# Altium project Projekt_Spannungsmessung_15kV.PrjPcb
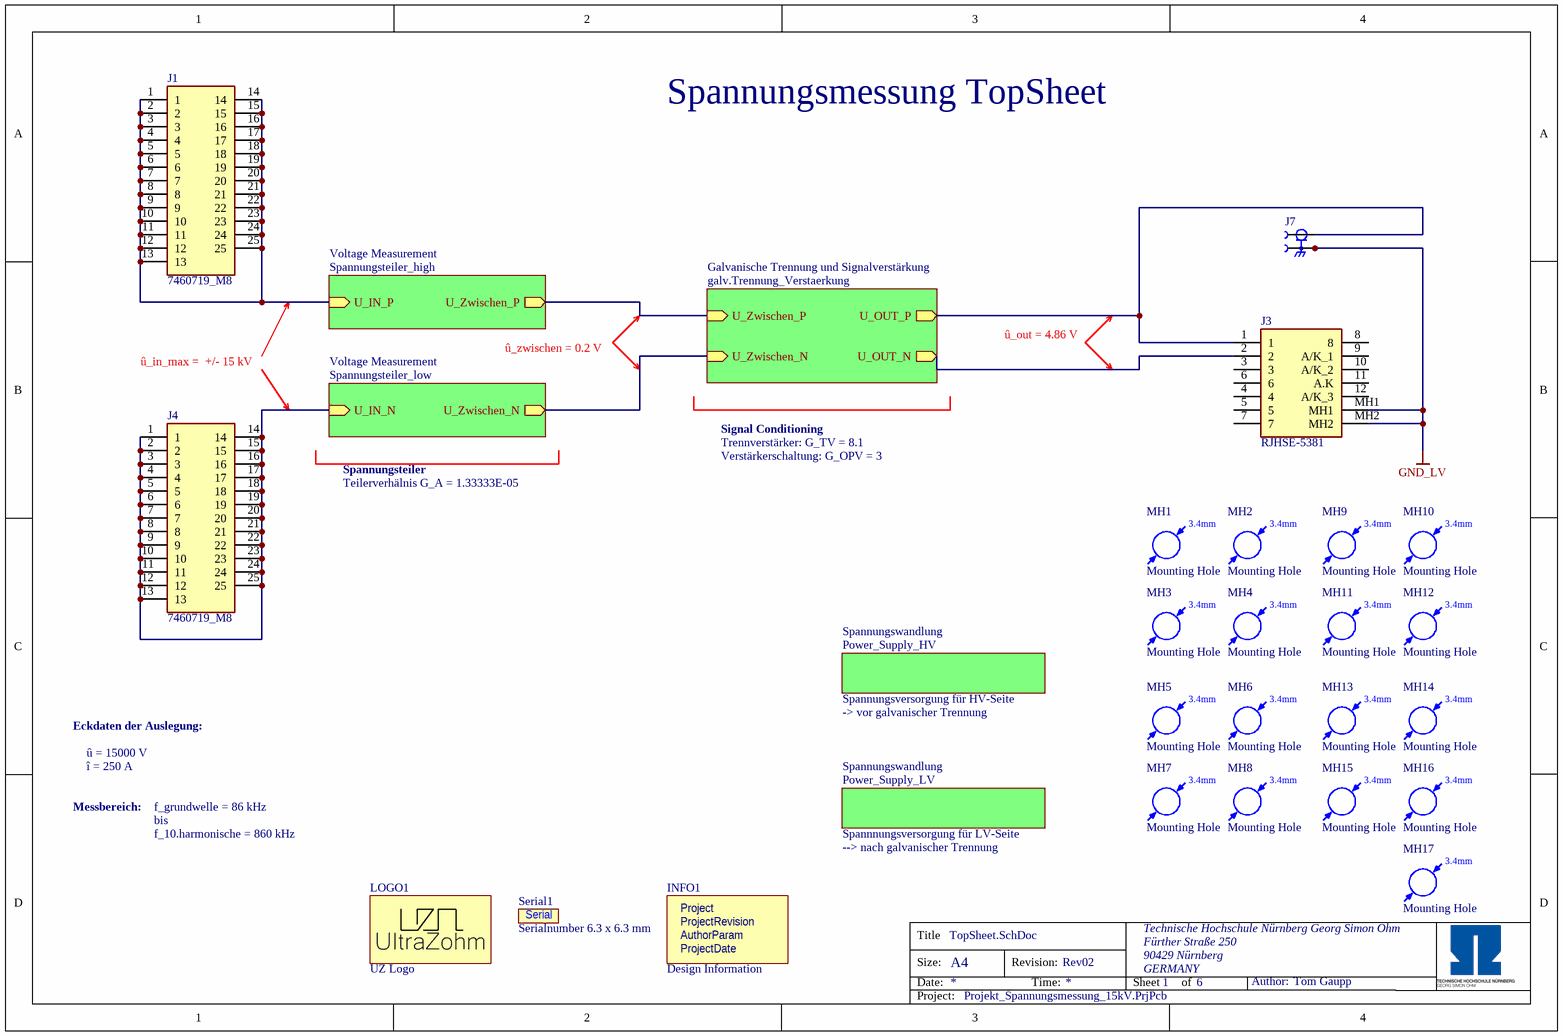
[diagram p0: TopSheet.SchDoc]
Author: Tom Gaupp; AuthorParam: T. Gaupp; Project: Spannungsmessung; ProjectDate: 08/23; ProjectRevision: Rev02
6 sheets, 368 parts. Net scope: hierarchical (ports join the sheet entries above them; power ports are global).
Board file: PCB_SpannungsmessungNEU.PcbDoc
Sheets:
  TopSheet.SchDoc
    Voltage Measurement = Spannungsteiler_high.SchDoc
    Spannungswandlung = Power_Supply_LV.SchDoc
    Spannungswandlung = Power_Supply_HV.SchDoc
    Galvanische Trennung und Signalverstärkung = galv.Trennung_Verstaerkung.SchDoc
    Voltage Measurement = Spannungsteiler_low.SchDoc

## Sheet TopSheet.SchDoc
size A4; Author: T. Gaupp; CompanyName: Technische Hochschule Nürnberg Georg Simon Ohm; Address1: Fürther Straße 250; Address2: 90429 Nürnberg; Address3: GERMANY; Revision: Rev02; SheetNumber: 1; SheetTotal: 6; CompanyName2: Institut ELSYS

### Parts
INFO1  Design Information  [Design_info]  (no BOM)
J1  7460719_M8  [7460719]
J3  RJHSE-5381  [RJHSE5381]
J4  7460719_M8  [7460719]
J7  BNC5-J-P-GN-ST-TH2D_new  [BNC5-J-P-GN-ST-TH2D_new]  (value not drawn)
LOGO1  UZ Logo  [UZ_Logo_small]  (no BOM)
MH1  Mounting Hole  [MH_3.4]
MH2  Mounting Hole  [MH_3.4]
MH3  Mounting Hole  [MH_3.4]
MH4  Mounting Hole  [MH_3.4]
MH5  Mounting Hole  [MH_3.4]
MH6  Mounting Hole  [MH_3.4]
MH7  Mounting Hole  [MH_3.4]
MH8  Mounting Hole  [MH_3.4]
MH9  Mounting Hole  [MH_3.4]
MH10  Mounting Hole  [MH_3.4]
MH11  Mounting Hole  [MH_3.4]
MH12  Mounting Hole  [MH_3.4]
MH13  Mounting Hole  [MH_3.4]
MH14  Mounting Hole  [MH_3.4]
MH15  Mounting Hole  [MH_3.4]
MH16  Mounting Hole  [MH_3.4]
MH17  Mounting Hole  [MH_3.4]
Serial1  Serialnumber 6.3 x 6.3 mm  [SERIAL_6.3X6.3MM]  (no BOM)

### Sub-sheets
Galvanische Trennung und Signalverstärkung = galv.Trennung_Verstaerkung: U_Zwischen_P (in), U_Zwischen_N (in), U_OUT_N (out), U_OUT_P (out)
Spannungswandlung = Power_Supply_LV: no entries
Spannungswandlung = Power_Supply_HV: no entries
Voltage Measurement = Spannungsteiler_high: U_IN_P (in), U_Zwischen_P (out)
Voltage Measurement = Spannungsteiler_low: U_IN_N (in), U_Zwischen_N (out)

### Nets
GND_LV: J3.MH1 J3.MH2 J7.S_1 J7.S_2 J7.S_3
U_OUT_N: J3.1 J7.1 ; sheet Galvanische Trennung und Signalverstärkung/U_OUT_P
U_OUT_P: J3.2 ; sheet Galvanische Trennung und Signalverstärkung/U_OUT_N
U_Zwischen_N: sheet Galvanische Trennung und Signalverstärkung/U_Zwischen_N, sheet Voltage Measurement/U_Zwischen_N
U_Zwischen_P: sheet Voltage Measurement/U_Zwischen_P, sheet Galvanische Trennung und Signalverstärkung/U_Zwischen_P
NetC13_1: J1.1 J1.2 J1.3 J1.4 J1.5 J1.6 J1.7 J1.8 J1.9 J1.10 J1.11 J1.12 J1.13 J1.14 J1.15 J1.16 J1.17 J1.18 J1.19 J1.20 J1.21 J1.22 J1.23 J1.24 J1.25 ; sheet Voltage Measurement/U_IN_P
NetC90_1: J4.1 J4.2 J4.3 J4.4 J4.5 J4.6 J4.7 J4.8 J4.9 J4.10 J4.11 J4.12 J4.13 J4.14 J4.15 J4.16 J4.17 J4.18 J4.19 J4.20 J4.21 J4.22 J4.23 J4.24 J4.25 ; sheet Voltage Measurement/U_IN_N

Not connected (* = marked no-connect by the designer): J3 3 4 5 6 7 8 9(A/K_1) 10(A/K_2) 11(A.K) 12(A/K_3)

### Notes on the sheet
- Spannungsmessung TopSheet
- û_in_max =  +/- 15 kV
- û_zwischen = 0.2 V
- û_out = 4.86 V
- Signal Conditioning
- Trennverstärker: G_TV = 8.1
- Spannungsteiler
- Teilerverhälnis G_A = 1.33333E-05
- Verstärkerschaltung: G_OPV = 3
- Spannungsversorgung für HV-Seite
- -> vor galvanischer Trennung
- Eckdaten der Auslegung:
- î = 250 A
- û = 15000 V
- Messbereich:
- f_grundwelle = 86 kHz
- f_10.harmonische = 860 kHz
- bis
- Spannnungsversorgung für LV-Seite
- --> nach galvanischer Trennung
- Title
- Size:
- Date:
- A4
- Revision:
- Time:
- Sheet
- of
- Author:
- Project:
- (in symbol Design Information) Project; ProjectRevision; AuthorParam; ProjectDate
- (in symbol Mounting Hole) 3.4mm
- (in symbol Serial Number) Serial

### Library data of the parts
INFO1 = Design Information: Design InformationS; Manufacturer: UltraZohm; Created from: MGremer; Manufacturer Part Number: Design Information; PartID: 12; Created On: 03.11.2021 09:04:23; ComponentLink1Description: https://docs.ultrazohm.com/; ComponentLink1URL: homepage; Component Type: Design Information; Last Updated: 03.11.2021 09:28:34; Supplier 1: -; Supplier Part Number 1: -; Type: Design Information; Value: Design Information; Live Cycle Status: 1
J1 J4 = 7460719_M8: Connector; Manufacturer_Name: Wurth Elektronik; Datasheet Link: https://www.mouser.com/datasheet/2/445/7460719-1723637.pdf; Height: 20.5mm; Manufacturer_Part_Number: 7460719; Mouser Part Number: 710-7460719; Mouser Price/Stock: https://www.mouser.co.uk/ProductDetail/Wurth-Elektronik/7460719?qs=lykWx4dhCCHoCGzpKhOnqA%3D%3D; Supplier 1: Mouser; Supplier Part Number 1: 710-7460719
J3 = RJHSE-5381: CAT5, RJ45 Connector, 1 port; Manufacturer: Amphenol; Created from: DHufnagel; Manufacturer Part Number: RJHSE-5381; PartID: 5; Created On: 14.06.2022 08:36:24; ComponentLink1Description: Datasheet; ComponentLink1URL: https://www.mouser.de/datasheet/2/18/1/io_modjack_rjhse-2509079.pdf; ComponentLink2Description: Drawing; ComponentLink2URL: https://cdn.amphenol-cs.com/media/wysiwyg/files/drawing/rjhsex38x.pdf; Component Type: RJ45 Connector; Device Package: RJ45; Last Updated: 14.06.2022 08:36:42; Mounting Type: THT; Series: RJHSE; Supplier 1: Mouser; Supplier Part Number 1: 523-RJHSE-5381; Type: RJ45 Connector; Live Cycle Status: 1; Stock number: not stored
J7 = BNC5-J-P-GN-ST-TH2D_new: BNC Connector; Supplier 1: Mouser; Supplier Part Number 1: 200-BNC5JPGNSTTH2D
LOGO1 = Logo small: Manufacturer: UltraZohm; Created from: MGremer; Created: Jan2021_Liegmann; Value: Logo; Manufacturer Part Number: Logo small; PartID: 10; Created On: 03.11.2021 09:04:23; ComponentLink1Description: https://docs.ultrazohm.com/; ComponentLink1URL: homepage; Component Type: Logo; Last Updated: 03.11.2021 09:05:50; Supplier 1: -; Supplier Part Number 1: -; Type: Logo; Live Cycle Status: 1
MH1-MH17 = Mounting Hole: Created from: MHlatky; Manufacturer Part Number: Mounting Hole; PartID: 16; Created On: 26.01.2021 09:19:51; ComponentLink1Description: Datasheet; Component Type: Mounting Hole; Device Package: -; Last Updated: 21.03.2022 23:05:12; Manufacturer: Mounting Hole; Supplier 1: Mounting Hole; Supplier Part Number 1: Mounting Hole; Type: Mounting Hole; Value: Mounting Hole; Live Cycle Status: 1; Stock number: not stored
Serial1 = Serial Number: Manufacturer: UltraZohm; Value: REV; Created from: MGremer; Created: 2018_09_18_AGeiger; Manufacturer Part Number: Serial Number; PartID: 11; Created On: 03.11.2021 09:04:23; ComponentLink1Description: https://docs.ultrazohm.com/; ComponentLink1URL: homepage; Component Type: Serial Number; Last Updated: 03.11.2021 09:28:34; Supplier 1: -; Supplier Part Number 1: -; Type: Serial Number; Live Cycle Status: 1

## Sheet Spannungsteiler_high.SchDoc
size A4; Author: T. Gaupp; CompanyName: Technische Hochschule Nürnberg Georg Simon Ohm; Address1: Fürther Straße 250; Address2: 90429 Nürnberg; Address3: GERMANY; SheetNumber: 4; SheetTotal: 6; CompanyName2: Institut ELSYS
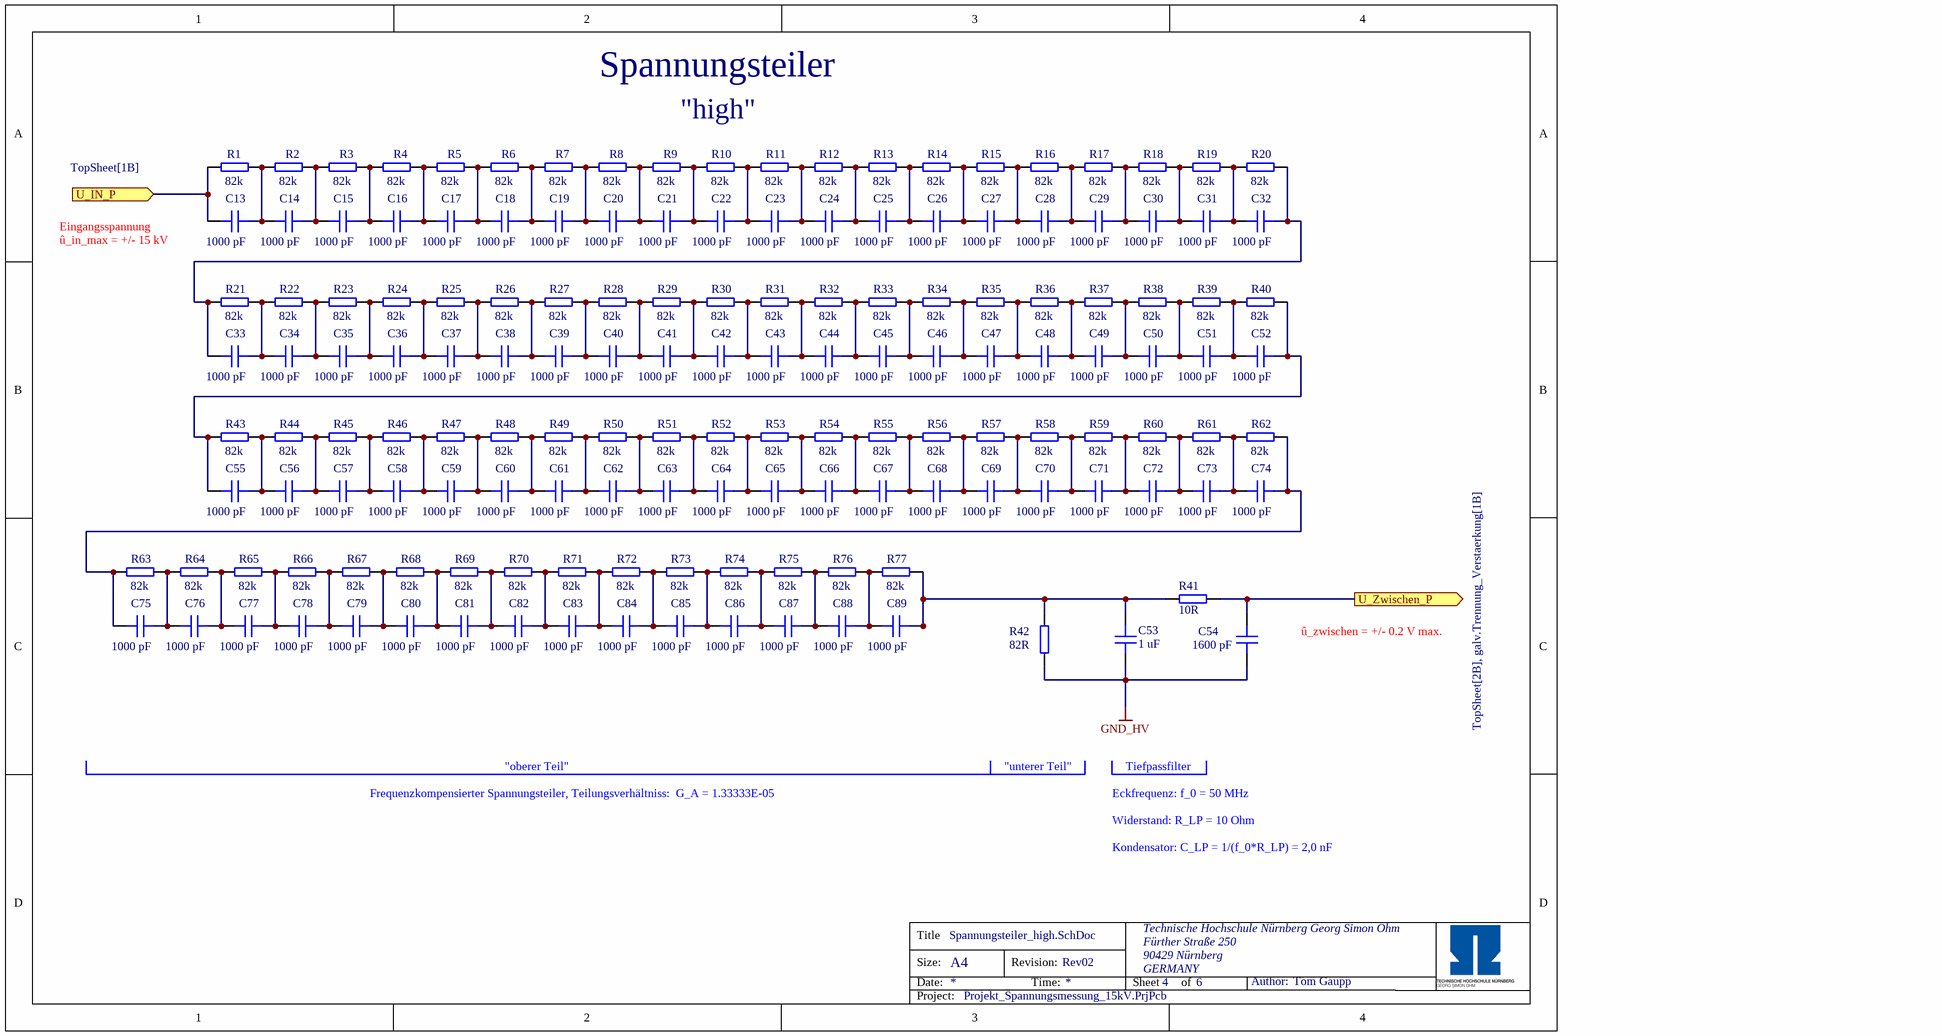
[diagram p1: Spannungsteiler_high.SchDoc]

### Parts
C13  1000 pF  [C_1206]
C14  1000 pF  [C_1206]
C15  1000 pF  [C_1206]
C16  1000 pF  [C_1206]
C17  1000 pF  [C_1206]
C18  1000 pF  [C_1206]
C19  1000 pF  [C_1206]
C20  1000 pF  [C_1206]
C21  1000 pF  [C_1206]
C22  1000 pF  [C_1206]
C23  1000 pF  [C_1206]
C24  1000 pF  [C_1206]
C25  1000 pF  [C_1206]
C26  1000 pF  [C_1206]
C27  1000 pF  [C_1206]
C28  1000 pF  [C_1206]
C29  1000 pF  [C_1206]
C30  1000 pF  [C_1206]
C31  1000 pF  [C_1206]
C32  1000 pF  [C_1206]
C33  1000 pF  [C_1206]
C34  1000 pF  [C_1206]
C35  1000 pF  [C_1206]
C36  1000 pF  [C_1206]
C37  1000 pF  [C_1206]
C38  1000 pF  [C_1206]
C39  1000 pF  [C_1206]
C40  1000 pF  [C_1206]
C41  1000 pF  [C_1206]
C42  1000 pF  [C_1206]
C43  1000 pF  [C_1206]
C44  1000 pF  [C_1206]
C45  1000 pF  [C_1206]
C46  1000 pF  [C_1206]
C47  1000 pF  [C_1206]
C48  1000 pF  [C_1206]
C49  1000 pF  [C_1206]
C50  1000 pF  [C_1206]
C51  1000 pF  [C_1206]
C52  1000 pF  [C_1206]
C53  1 uF  [C_1206]
C54  1600 pF  [C_1206]
C55  1000 pF  [C_1206]
C56  1000 pF  [C_1206]
C57  1000 pF  [C_1206]
C58  1000 pF  [C_1206]
C59  1000 pF  [C_1206]
C60  1000 pF  [C_1206]
C61  1000 pF  [C_1206]
C62  1000 pF  [C_1206]
C63  1000 pF  [C_1206]
C64  1000 pF  [C_1206]
C65  1000 pF  [C_1206]
C66  1000 pF  [C_1206]
C67  1000 pF  [C_1206]
C68  1000 pF  [C_1206]
C69  1000 pF  [C_1206]
C70  1000 pF  [C_1206]
C71  1000 pF  [C_1206]
C72  1000 pF  [C_1206]
C73  1000 pF  [C_1206]
C74  1000 pF  [C_1206]
C75  1000 pF  [C_1206]
C76  1000 pF  [C_1206]
C77  1000 pF  [C_1206]
C78  1000 pF  [C_1206]
C79  1000 pF  [C_1206]
C80  1000 pF  [C_1206]
C81  1000 pF  [C_1206]
C82  1000 pF  [C_1206]
C83  1000 pF  [C_1206]
C84  1000 pF  [C_1206]
C85  1000 pF  [C_1206]
C86  1000 pF  [C_1206]
C87  1000 pF  [C_1206]
C88  1000 pF  [C_1206]
C89  1000 pF  [C_1206]
R1  82k  [RES 1206_3216]
R2  82k  [RES 1206_3216]
R3  82k  [RES 1206_3216]
R4  82k  [RES 1206_3216]
R5  82k  [RES 1206_3216]
R6  82k  [RES 1206_3216]
R7  82k  [RES 1206_3216]
R8  82k  [RES 1206_3216]
R9  82k  [RES 1206_3216]
R10  82k  [RES 1206_3216]
R11  82k  [RES 1206_3216]
R12  82k  [RES 1206_3216]
R13  82k  [RES 1206_3216]
R14  82k  [RES 1206_3216]
R15  82k  [RES 1206_3216]
R16  82k  [RES 1206_3216]
R17  82k  [RES 1206_3216]
R18  82k  [RES 1206_3216]
R19  82k  [RES 1206_3216]
R20  82k  [RES 1206_3216]
R21  82k  [RES 1206_3216]
R22  82k  [RES 1206_3216]
R23  82k  [RES 1206_3216]
R24  82k  [RES 1206_3216]
R25  82k  [RES 1206_3216]
R26  82k  [RES 1206_3216]
R27  82k  [RES 1206_3216]
R28  82k  [RES 1206_3216]
R29  82k  [RES 1206_3216]
R30  82k  [RES 1206_3216]
R31  82k  [RES 1206_3216]
R32  82k  [RES 1206_3216]
R33  82k  [RES 1206_3216]
R34  82k  [RES 1206_3216]
R35  82k  [RES 1206_3216]
R36  82k  [RES 1206_3216]
R37  82k  [RES 1206_3216]
R38  82k  [RES 1206_3216]
R39  82k  [RES 1206_3216]
R40  82k  [RES 1206_3216]
R41  10R  [RES 0603_1608]
R42  82R  [RES 1206_3216]
R43  82k  [RES 1206_3216]
R44  82k  [RES 1206_3216]
R45  82k  [RES 1206_3216]
R46  82k  [RES 1206_3216]
R47  82k  [RES 1206_3216]
R48  82k  [RES 1206_3216]
R49  82k  [RES 1206_3216]
R50  82k  [RES 1206_3216]
R51  82k  [RES 1206_3216]
R52  82k  [RES 1206_3216]
R53  82k  [RES 1206_3216]
R54  82k  [RES 1206_3216]
R55  82k  [RES 1206_3216]
R56  82k  [RES 1206_3216]
R57  82k  [RES 1206_3216]
R58  82k  [RES 1206_3216]
R59  82k  [RES 1206_3216]
R60  82k  [RES 1206_3216]
R61  82k  [RES 1206_3216]
R62  82k  [RES 1206_3216]
R63  82k  [RES 1206_3216]
R64  82k  [RES 1206_3216]
R65  82k  [RES 1206_3216]
R66  82k  [RES 1206_3216]
R67  82k  [RES 1206_3216]
R68  82k  [RES 1206_3216]
R69  82k  [RES 1206_3216]
R70  82k  [RES 1206_3216]
R71  82k  [RES 1206_3216]
R72  82k  [RES 1206_3216]
R73  82k  [RES 1206_3216]
R74  82k  [RES 1206_3216]
R75  82k  [RES 1206_3216]
R76  82k  [RES 1206_3216]
R77  82k  [RES 1206_3216]

### Ports
U_IN_P (in, see TopSheet[1B]), U_Zwischen_P (out, see TopSheet[2B], galv.Trennung_Verstaerkung[1B])

### Nets
GND_HV: C53.1 C54.1 R42.1
U_Zwischen_P: C54.2 R41.2 ; port U_Zwischen_P
NetC13_1: C13.1 R1.1 ; port U_IN_P
NetC13_2: C13.2 C14.1 R1.2 R2.1
NetC14_2: C14.2 C15.1 R2.2 R3.1
NetC15_2: C15.2 C16.1 R3.2 R4.1
NetC16_2: C16.2 C17.1 R4.2 R5.1
NetC17_2: C17.2 C18.1 R5.2 R6.1
NetC18_2: C18.2 C19.1 R6.2 R7.1
NetC19_2: C19.2 C20.1 R7.2 R8.1
NetC20_2: C20.2 C21.1 R8.2 R9.1
NetC21_2: C21.2 C22.1 R9.2 R10.1
NetC22_2: C22.2 C23.1 R10.2 R11.1
NetC23_2: C23.2 C24.1 R11.2 R12.1
NetC24_2: C24.2 C25.1 R12.2 R13.1
NetC25_2: C25.2 C26.1 R13.2 R14.1
NetC26_2: C26.2 C27.1 R14.2 R15.1
NetC27_2: C27.2 C28.1 R15.2 R16.1
NetC28_2: C28.2 C29.1 R16.2 R17.1
NetC29_2: C29.2 C30.1 R17.2 R18.1
NetC30_2: C30.2 C31.1 R18.2 R19.1
NetC31_2: C31.2 C32.1 R19.2 R20.1
NetC32_2: C32.2 C33.1 R20.2 R21.1
NetC33_2: C33.2 C34.1 R21.2 R22.1
NetC34_2: C34.2 C35.1 R22.2 R23.1
NetC35_2: C35.2 C36.1 R23.2 R24.1
NetC36_2: C36.2 C37.1 R24.2 R25.1
NetC37_2: C37.2 C38.1 R25.2 R26.1
NetC38_2: C38.2 C39.1 R26.2 R27.1
NetC39_2: C39.2 C40.1 R27.2 R28.1
NetC40_2: C40.2 C41.1 R28.2 R29.1
NetC41_2: C41.2 C42.1 R29.2 R30.1
NetC42_2: C42.2 C43.1 R30.2 R31.1
NetC43_2: C43.2 C44.1 R31.2 R32.1
NetC44_2: C44.2 C45.1 R32.2 R33.1
NetC45_2: C45.2 C46.1 R33.2 R34.1
NetC46_2: C46.2 C47.1 R34.2 R35.1
NetC47_2: C47.2 C48.1 R35.2 R36.1
NetC48_2: C48.2 C49.1 R36.2 R37.1
NetC49_2: C49.2 C50.1 R37.2 R38.1
NetC50_2: C50.2 C51.1 R38.2 R39.1
NetC51_2: C51.2 C52.1 R39.2 R40.1
NetC52_2: C52.2 C55.1 R40.2 R43.1
NetC53_2: C53.2 C89.2 R41.1 R42.2 R77.2
NetC55_2: C55.2 C56.1 R43.2 R44.1
NetC56_2: C56.2 C57.1 R44.2 R45.1
NetC57_2: C57.2 C58.1 R45.2 R46.1
NetC58_2: C58.2 C59.1 R46.2 R47.1
NetC59_2: C59.2 C60.1 R47.2 R48.1
NetC60_2: C60.2 C61.1 R48.2 R49.1
NetC61_2: C61.2 C62.1 R49.2 R50.1
NetC62_2: C62.2 C63.1 R50.2 R51.1
NetC63_2: C63.2 C64.1 R51.2 R52.1
NetC64_2: C64.2 C65.1 R52.2 R53.1
NetC65_2: C65.2 C66.1 R53.2 R54.1
NetC66_2: C66.2 C67.1 R54.2 R55.1
NetC67_2: C67.2 C68.1 R55.2 R56.1
NetC68_2: C68.2 C69.1 R56.2 R57.1
NetC69_2: C69.2 C70.1 R57.2 R58.1
NetC70_2: C70.2 C71.1 R58.2 R59.1
NetC71_2: C71.2 C72.1 R59.2 R60.1
NetC72_2: C72.2 C73.1 R60.2 R61.1
NetC73_2: C73.2 C74.1 R61.2 R62.1
NetC74_2: C74.2 C75.1 R62.2 R63.1
NetC75_2: C75.2 C76.1 R63.2 R64.1
NetC76_2: C76.2 C77.1 R64.2 R65.1
NetC77_2: C77.2 C78.1 R65.2 R66.1
NetC78_2: C78.2 C79.1 R66.2 R67.1
NetC79_2: C79.2 C80.1 R67.2 R68.1
NetC80_2: C80.2 C81.1 R68.2 R69.1
NetC81_2: C81.2 C82.1 R69.2 R70.1
NetC82_2: C82.2 C83.1 R70.2 R71.1
NetC83_2: C83.2 C84.1 R71.2 R72.1
NetC84_2: C84.2 C85.1 R72.2 R73.1
NetC85_2: C85.2 C86.1 R73.2 R74.1
NetC86_2: C86.2 C87.1 R74.2 R75.1
NetC87_2: C87.2 C88.1 R75.2 R76.1
NetC88_2: C88.2 C89.1 R76.2 R77.1

### Notes on the sheet
- Spannungsteiler
- "high"
- Eingangsspannung
- û_in_max = +/- 15 kV
- û_zwischen = +/- 0.2 V max.
- "oberer Teil"
- "unterer Teil"
- Tiefpassfilter
- Frequenzkompensierter Spannungsteiler, Teilungsverhältniss:  G_A = 1.33333E-05
- Eckfrequenz: f_0 = 50 MHz
- Widerstand: R_LP = 10 Ohm
- Kondensator: C_LP = 1/(f_0*R_LP) = 2,0 nF
- Title
- Size:
- Date:
- A4
- Revision:
- Time:
- Sheet
- of
- Author:
- Project:

### Library data of the parts
C13-C52 C55-C89 = C1206C102J2GACTU: Capacitor 1206, 200VDC, 1000pF, C0G, 5%; Manufacturer: KEMET; Created from: TGaupp; Supplier 1: Mouser; Supplier Part Number 1: 80-C1206C102J2G; Value: 1000 pF; Manufacturer Part Number: C1206C102J2GACTU; PartID: 135; Created On: 08.08.2023 10:37:32; ComponentLink1Description: Datasheet; ComponentLink1URL: https://www.mouser.de/datasheet/2/212/KEM_C1003_C0G_SMD-1101588.pdf; Component Type: Capacitor 1206; Device Package: 1206; Last Updated: 08.08.2023 10:37:39; Mounting Type: SMD; Operating Temperature: -55 - 125°C; Series: SMD Comm C0G; Type: Capacitor; Tolerance: 5 %; Voltage Rating: 200 VDC; Live Cycle Status: 1; LCSC Part Number: C2167363; Stock number: not stored
C53 = C1206X105J5RACTU: Capacitor 1206, 50V, 1uF, X7R, 5%; Manufacturer: KEMET; Voltage Rating: 50 VDC; Created from: TGaupp; Manufacturer Part Number: C1206X105J5RACTU; PartID: 137; Created On: 28.08.2023 09:04:24; ComponentLink1Description: Datasheet; ComponentLink1URL: https://www.mouser.de/datasheet/2/212/1/KEM_C1013_X7R_FT_CAP_SMD-1103280.pdf; Component Type: Capacitor 1206; Device Package: 1206; Last Updated: 28.08.2023 09:04:24; Mounting Type: SMD; Operating Temperature: -55 - 125°C; Series: SMD Comm X7R Flex; Supplier 1: Mouser; Supplier Part Number 1: 80-C1206X105J5RACTU; Type: Capacitor; Tolerance: 5 %; Value: 1 uF; Live Cycle Status: 1; Stock number: not stored
C54 = C1206C162K3HACTU: Capacitor 1206, 25V, 1600pF, X8R, 10%; Manufacturer: KEMET; Tolerance: 12 %; Voltage Rating: 25 VDC; Created from: TGaupp; Supplier 1: Mouser; Supplier Part Number 1: 80-C1206C162K3HACTU; Value: 1600 pF; Manufacturer Part Number: C1206C162K3HACTU; PartID: 136; Created On: 08.08.2023 12:37:56; ComponentLink1Description: Datasheet; ComponentLink1URL: https://www.mouser.de/datasheet/2/212/KEM_C1007_X8R_ULTRA_150C_SMD-1102703.pdf; Component Type: Capacitor 1206; Device Package: 1206; Last Updated: 08.08.2023 12:37:56; Mounting Type: SMD; Operating Temperature: -55 - 125°C; Series: SMD Comm X8R HT150C; Type: Capacitor; Live Cycle Status: 1; Stock number: not stored
R1-R40 R43-R77 = TNPW120682K0BEEA: SMD resistor 82Kohms .1% 25ppm; Manufacturer: Vishay; Tolerance: 0.1%; Created from: TGaupp; Supplier 1: Mouser; Supplier Part Number 1: 71-TNPW120682K0BEEA; Value: 82k; Manufacturer Part Number: TNPW120682K0BEEA; PartID: 290; Created On: 08.08.2023 09:29:01; ComponentLink1Description: Datasheet; ComponentLink1URL: https://www.vishay.com/docs/28758/tnpw_e3.pdf; Component Type: SMD resistor; Device Package: 1206; Last Updated: 08.08.2023 09:29:01; Mounting Type: SMD; Type: Resistor; Live Cycle Status: 1; Stock number: not stored; LCSC Part Number: C2089369
R41 = CRCW060310R0FKTA: SMD 1/10watt 10ohms 1%; Manufacturer: Vishay; Created from: TGaupp; Manufacturer Part Number: CRCW060310R0FKTA; PartID: 296; Created On: 28.08.2023 12:16:52; ComponentLink1Description: Datasheet; ComponentLink1URL: https://www.vishay.com/docs/20008/dcrcw.pdf; Component Type: SMD resistor; Device Package: 0603; Last Updated: 28.08.2023 12:16:52; Mounting Type: SMD; Supplier 1: Mouser; Supplier Part Number 1: 71-CRCW0603-10; Type: Resistor; Tolerance: 1 %; Value: 10R; Live Cycle Status: 1; Stock number: not stored; LCSC Part Number: C2091419
R42 = RT1206BRD0782RL: SMD resistor 1/4W 82 ohm .1% 25ppm; Manufacturer: YAGEO; Tolerance: 0.1%; Created from: TGaupp; Supplier 1: Mouser; Supplier Part Number 1: 603-RT1206BRD0782RL; Value: 82R; Manufacturer Part Number: RT1206BRD0782RL; PartID: 291; Created On: 08.08.2023 10:07:21; ComponentLink1Description: Datasheet; ComponentLink1URL: https://www.mouser.de/datasheet/2/447/PYu_RT_1_to_0_01_RoHS_L_12-3003070.pdf; Component Type: SMD resistor; Device Package: 1206; Last Updated: 08.08.2023 10:07:21; Mounting Type: SMD; Type: Resistor; Live Cycle Status: 1; Stock number: not stored; LCSC Part Number: C870908

## Sheet Power_Supply_LV.SchDoc
size A4; Author: T. Gaupp; CompanyName: Technische Hochschule Nürnberg Georg Simon Ohm; DrawnBy: T Gaupp; Address1: Fürther Straße 250; Address2: 90429 Nürnberg; Address3: GERMANY; SheetNumber: 3; SheetTotal: 6; CompanyName2: Institut ELSYS
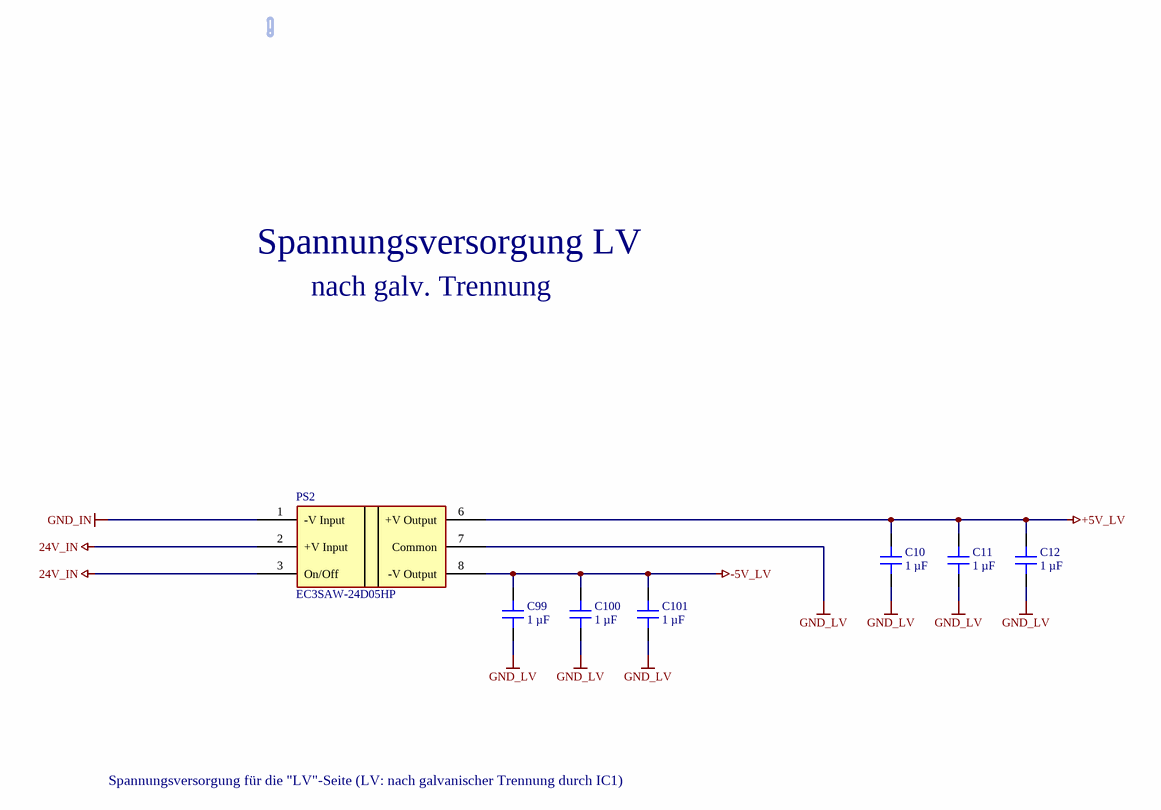
[diagram p2: Power_Supply_LV.SchDoc]

### Parts
C10  1 µF  [C_0603]
C11  1 µF  [C_0603]
C12  1 µF  [C_0603]
C99  1 µF  [C_0603]
C100  1 µF  [C_0603]
C101  1 µF  [C_0603]
PS2  EC3SAW-24D05HP  [EC3SAW]

### Nets
24V_IN: PS2.2(+V_Input) PS2.3(On/Off)
+5V_LV: C10.2 C11.2 C12.2 PS2.6(+V_Output)
-5V_LV: C99.2 C100.2 C101.2 PS2.8(-V_Output)
GND_IN: PS2.1(-V_Input)
GND_LV: C10.1 C11.1 C12.1 C99.1 C100.1 C101.1 PS2.7(Common)

### Notes on the sheet
- Spannungsversorgung LV
- nach galv. Trennung
- Spannungsversorgung für die "LV"-Seite (LV: nach galvanischer Trennung durch IC1)
- Title
- Size:
- Date:
- A4
- Revision:
- Time:
- Sheet
- of
- Author:
- Project:

### Library data of the parts
C10-C12 C99-C101 = CL10A105KB8NNNC: 50V 1uF X5R ±10% 0603  Multilayer Ceramic Capacitors MLCC - SMD/SMT ROHS; Manufacturer: Samsung Electro-Mechanics; Voltage Rating: 50 VDC; Created from: MGremer; Supplier 1: LCSC; Supplier Part Number 1: C15849; Manufacturer Part Number: CL10A105KB8NNNC; Value: 1 µF; PartID: 5; Created On: 20.12.2020 13:54:13; ComponentLink1Description: Datasheet; ComponentLink1URL: https://datasheet.lcsc.com/lcsc/1810261812_Samsung-Electro-Mechanics-CL10A105KB8NNNC_C15849.pdf; Component Type: Capacitor 0603; Device Package: 0603; Last Updated: 28.11.2022 17:23:01; Mounting Type: SMD; Operating Temperature: -55 - 85°C; Series: M; Type: Capacitor; Tolerance: 10 %; Live Cycle Status: 1; LCSC Part Number: C15849; Stock number: Labor SMD Container
PS2 = EC3SAW-24D05HP: Isolierte DC/DC-Wandler – Durchsteckmontage 3W 9-36Vin +/-5Vout 300mA; Manufacturer: Cincon; Supplier 1: Mouser; Supplier Part Number 1: 418-EC3SAW-24D05HP; Man Part Number: EC3SAW-24D05HP

## Sheet Power_Supply_HV.SchDoc
size A4; Author: T. Gaupp; CompanyName: Technische Hochschule Nürnberg Georg Simon Ohm; Address1: Fürther Straße 250; Address2: 90429 Nürnberg; Address3: GERMANY; SheetNumber: 2; SheetTotal: 6; CompanyName2: Institut ELSYS
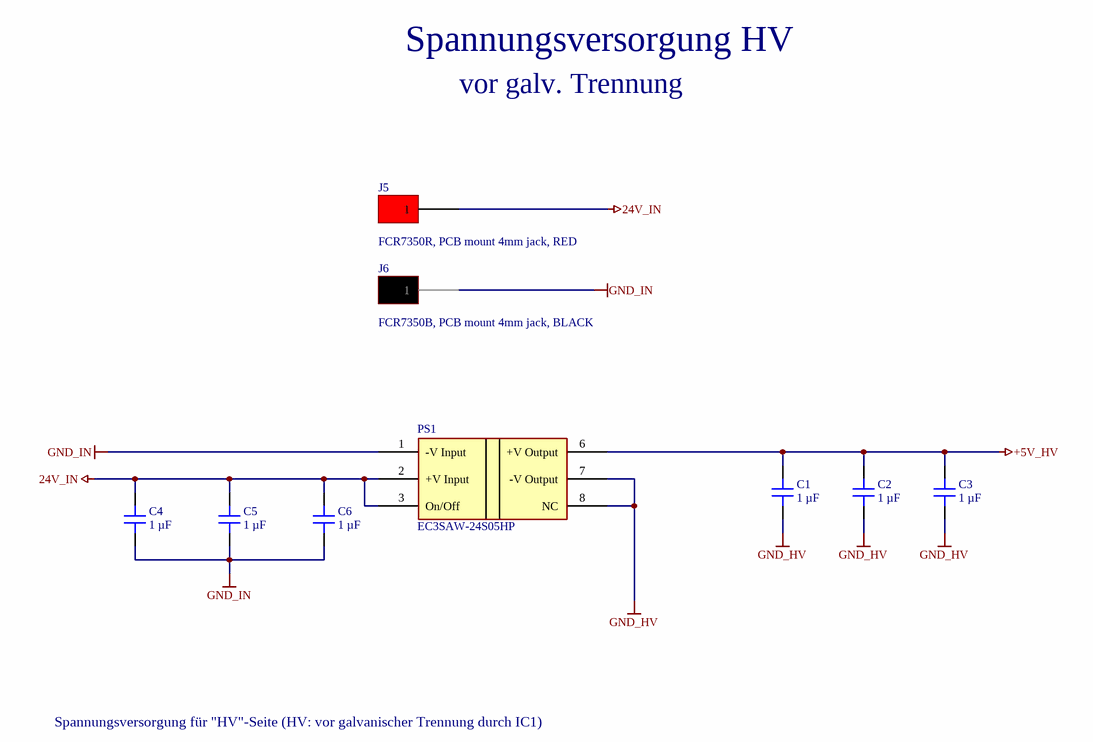
[diagram p3: Power_Supply_HV.SchDoc]

### Parts
C1  1 µF  [C_0603]
C2  1 µF  [C_0603]
C3  1 µF  [C_0603]
C4  1 µF  [C_0603]
C5  1 µF  [C_0603]
C6  1 µF  [C_0603]
J5  FCR7350R, PCB mount 4mm jack, RED  [FCR7350]
J6  FCR7350B, PCB mount 4mm jack, BLACK  [FCR7350]
PS1  EC3SAW-24S05HP  [EC3SAW]

### Nets
24V_IN: C4.1 C5.1 C6.1 J5.1 PS1.2(+V_Input) PS1.3(On/Off)
+5V_HV: C1.1 C2.1 C3.1 PS1.6(+V_Output)
GND_HV: C1.2 C2.2 C3.2 PS1.7(-V_Output) PS1.8(NC)
GND_IN: C4.2 C5.2 C6.2 J6.1 PS1.1(-V_Input)

### Notes on the sheet
- Spannungsversorgung HV
- vor galv. Trennung
- Spannungsversorgung für "HV"-Seite (HV: vor galvanischer Trennung durch IC1)
- Title
- Size:
- Date:
- A4
- Revision:
- Time:
- Sheet
- of
- Author:
- Project:

### Library data of the parts
C1-C6 = CL10A105KB8NNNC: as C10 on sheet Power_Supply_LV; Supplier 1: LCSC; Supplier Part Number 1: C15849; Manufacturer Part Number: CL10A105KB8NNNC; Value: 1 µF; PartID: 5; Created On: 20.12.2020 13:54:13; ComponentLink1Description: Datasheet; ComponentLink1URL: https://datasheet.lcsc.com/lcsc/1810261812_Samsung-Electro-Mechanics-CL10A105KB8NNNC_C15849.pdf; Component Type: Capacitor 0603; Device Package: 0603; Last Updated: 28.11.2022 17:23:01; Mounting Type: SMD; Operating Temperature: -55 - 85°C; Series: M; Type: Capacitor; Tolerance: 10 %; Live Cycle Status: 1; LCSC Part Number: C15849; Stock number: Labor SMD Container
J5 = FCR7350R: FCR7350B, 1000V, 24A, RED; Manufacturer: Cliff; Value: PCB mount 4mm jack, Red FCR7350R, 1000V, 24A; Created from: DHufnagel; Manufacturer Part Number: FCR7350R; PartID: 7; Created On: 13.06.2022 10:18:11; ComponentLink1Description: datasheet; ComponentLink1URL: https://www.cliffuk.co.uk/products/testleads/sockets/S16NPC.pdf; ComponentLink2Description: drawing; ComponentLink2URL: https://media.digikey.com/pdf/Data%20Sheets/Cliff%20Electronic%20LTD%20PDF's/FCR7350_Drawing.pdf; Component Type: PCB mount 4mm jack, Red; Device Package: THT; Last Updated: 28.06.2022 13:58:37; Minimum Order: 1; Mounting Type: THT; Operating Temperature: -40°C - 80°C; Series: S16N-PC; Supplier 1: Digi-Key; Supplier Part Number 1: 3185-FCR7350R-ND; Supplier 2: farnell; Supplier Part Number 2: 1854508; Type: PCB mount 4mm jack, Red FCR7350R, 1000V, 24A; Live Cycle Status: 1; Stock number: not stored
J6 = FCR7350B: FCR7350B, 1000V, 24A, BLACK; Manufacturer: Cliff; Value: PCB mount 4mm jack, Black	FCR7350B, 1000V, 24A; Created from: DHufnagel; Manufacturer Part Number: FCR7350B; PartID: 6; Created On: 13.06.2022 10:18:11; ComponentLink1Description: datasheet; ComponentLink1URL: https://www.cliffuk.co.uk/products/testleads/sockets/S16NPC.pdf; ComponentLink2Description: drawing; ComponentLink2URL: https://media.digikey.com/pdf/Data%20Sheets/Cliff%20Electronic%20LTD%20PDF's/FCR7350_Drawing.pdf; Component Type: PCB mount 4mm jack, Black; Device Package: THT; Last Updated: 28.06.2022 13:58:37; Minimum Order: 1; Mounting Type: THT; Operating Temperature: -40°C - 80°C; Series: S16N-PC; Supplier 1: Digi-Key; Supplier Part Number 1: 3185-FCR7350B-ND; Supplier 2: farnell; Supplier Part Number 2: 1854507; Type: PCB mount 4mm jack, Black	FCR7350B, 1000V, 24A; Live Cycle Status: 1; Stock number: not stored
PS1 = EC3SAW-24S05HP: Isolierte DC/DC-Wandler – Durchsteckmontage 3W 9-36Vin 5Vout 600mA; Supplier 1: Mouser; Supplier Part Number 1: 418-EC3SAW-24S05HP

## Sheet galv.Trennung_Verstaerkung.SchDoc
size A4; Author: T. Gaupp; CompanyName: Technische Hochschule Nürnberg Georg Simon Ohm; Address1: Fürther Straße 250; Address2: 90429 Nürnberg; Address3: GERMANY; SheetNumber: 6; SheetTotal: 6; CompanyName2: Institut ELSYS
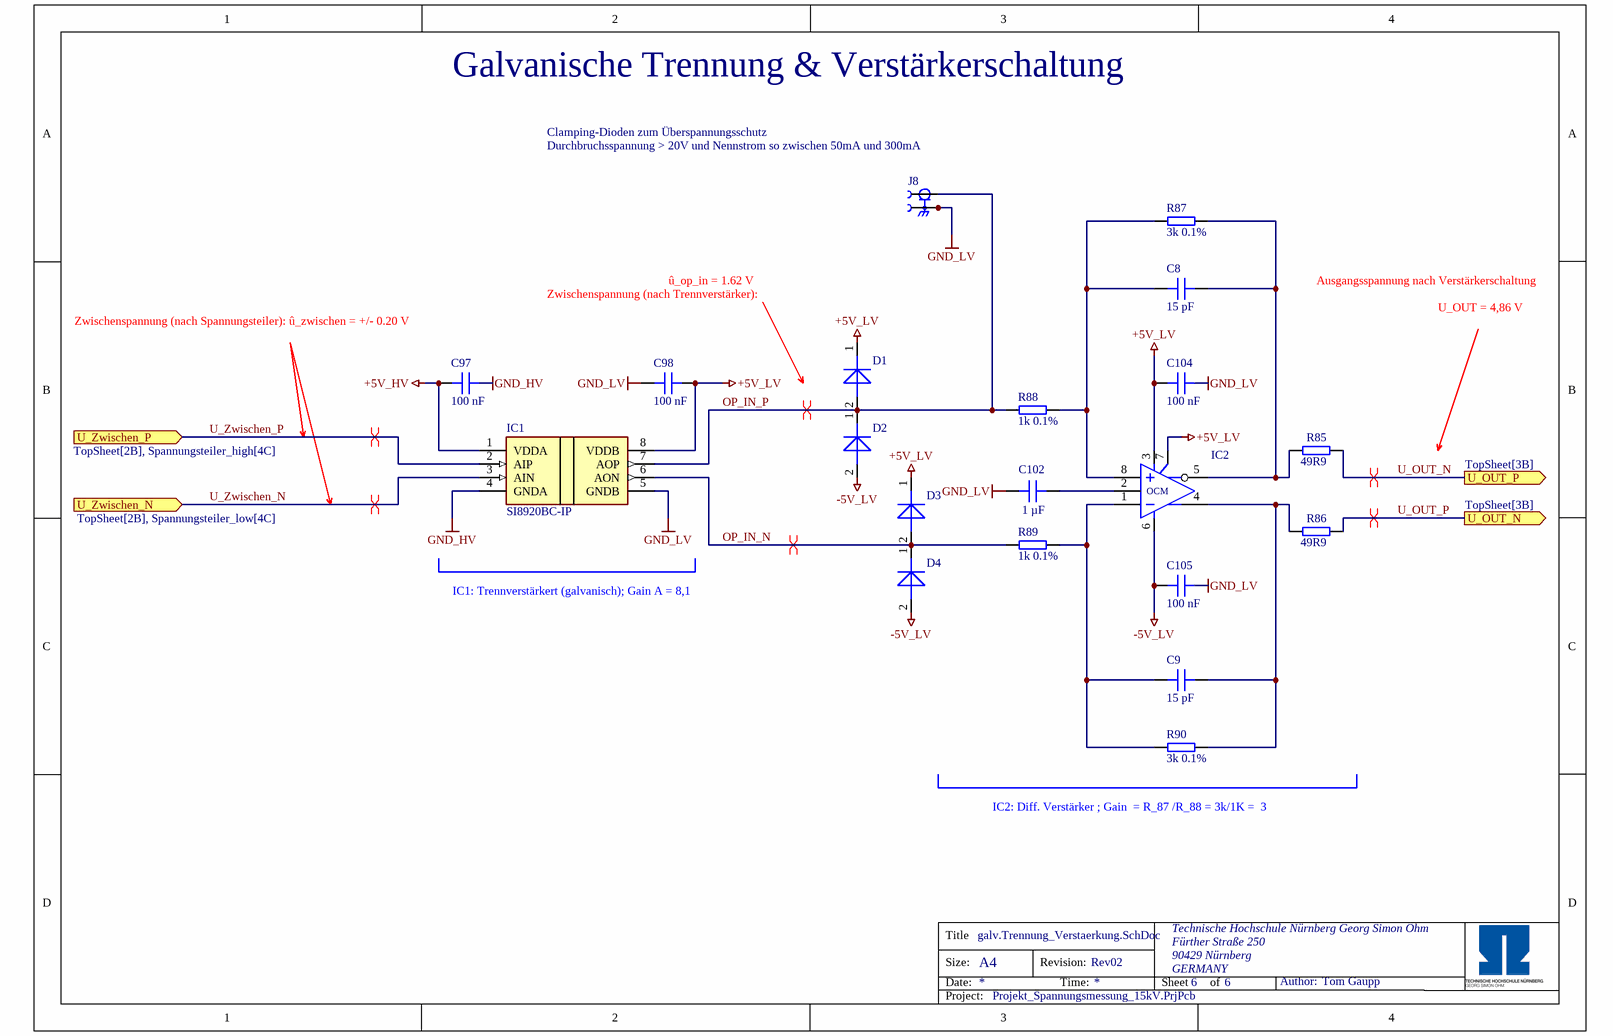
[diagram p4: galv.Trennung_Verstaerkung.SchDoc]

### Parts
C8  15 pF  [C_0805]
C9  15 pF  [C_0805]
C97  100 nF  [C_0603]
C98  100 nF  [C_0603]
C102  1 µF  [C_0603]
C104  100 nF  [C_0603]
C105  100 nF  [C_0603]
D1  1SS356VMFHTE-17  [1SS356VMFHTE17]  (value not drawn)
D2  1SS356VMFHTE-17  [1SS356VMFHTE17]  (value not drawn)
D3  1SS356VMFHTE-17  [1SS356VMFHTE17]  (value not drawn)
D4  1SS356VMFHTE-17  [1SS356VMFHTE17]  (value not drawn)
IC1  SI8920BC-IP  [SI8920BCIP]
IC2  ADA4940-1ARZ-R7  [SOIC-8-N]  (value not drawn)
J8  BNC5-J-P-GN-ST-TH2D_new  [BNC5-J-P-GN-ST-TH2D_new]  (value not drawn)
R85  49R9  [RES 0603_1608]
R86  49R9  [RES 0603_1608]
R87  3k 0.1%  [R1206_3216]
R88  1k 0.1%  [R1206_3216]
R89  1k 0.1%  [R1206_3216]
R90  3k 0.1%  [R1206_3216]

### Ports
U_OUT_N (out, see TopSheet[3B]), U_OUT_P (out, see TopSheet[3B]), U_Zwischen_N (in, see TopSheet[2B], Spannungsteiler_low[4C]), U_Zwischen_P (in, see TopSheet[2B], Spannungsteiler_high[4C])

### Nets
+5V_HV: C97.1 IC1.1(VDDA)
+5V_LV: C98.2 C104.1 D1.1(K) D3.1(K) IC1.8(VDDB) IC2.3(V+) IC2.7(EN)
-5V_LV: C105.1 D2.2(A) D4.2(A) IC2.6(V-)
GND_HV: C97.2 IC1.4(GNDA)
GND_LV: C98.1 C102.1 C104.2 C105.2 IC1.5(GNDB) J8.S_1 J8.S_2 J8.S_3
OP_IN_N: D3.2(A) D4.1(K) IC1.6(AON) R89.1
OP_IN_P: D1.2(A) D2.1(K) IC1.7(AOP) J8.1 R88.1
U_OUT_N: R85.2 ; port U_OUT_P
U_OUT_P: R86.2 ; port U_OUT_N
U_Zwischen_N: IC1.3(AIN) ; port U_Zwischen_N
U_Zwischen_P: IC1.2(AIP) ; port U_Zwischen_P
NetC8_1: C8.1 IC2.8(+) R87.1 R88.2
NetC8_2: C8.2 IC2.5(Out) R85.1 R87.2
NetC9_1: C9.1 IC2.1(-) R89.2 R90.1
NetC9_2: C9.2 IC2.4(Out) R86.1 R90.2
NetC102_2: C102.2 IC2.2(OCM)

### Layout directives
differential pair: OP_IN_N, OP_IN_P, U_OUT_N, U_OUT_P, U_Zwischen_N, U_Zwischen_P

### Notes on the sheet
- Galvanische Trennung & Verstärkerschaltung
- Clamping-Dioden zum Überspannungsschutz
- (near J8) Durchbruchsspannung > 20V und Nennstrom so zwischen 50mA und 300mA
- Zwischenspannung (nach Trennverstärker):
- û_op_in = 1.62 V
- Ausgangsspannung nach Verstärkerschaltung
- U_OUT = 4,86 V
- Zwischenspannung (nach Spannungsteiler): û_zwischen = +/- 0.20 V
- IC1: Trennverstärkert (galvanisch); Gain A = 8,1
- IC2: Diff. Verstärker ; Gain  = R_87 /R_88 = 3k/1K =  3
- Title
- Size:
- Date:
- A4
- Revision:
- Time:
- Sheet
- of
- Author:
- Project:

### Library data of the parts
C8 C9 = 08053C150KAT2A: Capacitor 0805, 25 VDC, 15 pF, X7R; Manufacturer: AVX; Tolerance: 10 %; Voltage Rating: 25 VDC; Created from: MGremer; Manufacturer Part Number: 08053C150KAT2A; PartID: 18; Created On: 20.12.2020 13:54:13; ComponentLink1Description: Datasheet; ComponentLink1URL: https://www.mouser.de/datasheet/2/40/X7RDielectric-777024.pdf; Component Type: Capacitor 0805; Device Package: 0805; Last Updated: 20.12.2020 16:34:30; Mounting Type: SMD; Operating Temperature: -55 - 125°C; Series: MLCC X7R; Supplier 1: Mouser; Supplier Part Number 1: 581-08053C150KAT2A; Type: Capacitor; Value: 15 pF; Live Cycle Status: 1; Stock number: Labor SMD Container
C97 C98 C104 C105 = C0603C104K9PACTU: Capacitor 0603, 6.3 VDC, 100 nF, X5R; Manufacturer: KEMET; Tolerance: 10 %; Voltage Rating: 6.3 VDC; Created from: MGremer; Manufacturer Part Number: C0603C104K9PACTU; PartID: 70; Created On: 20.12.2020 13:54:13; ComponentLink1Description: Datasheet; ComponentLink1URL: https://www.mouser.de/datasheet/2/212/KEM_C1006_X5R_SMD-1103249.pdf; Component Type: Capacitor 0603; Device Package: 0603; Last Updated: 20.01.2021 13:57:36; Mounting Type: SMD; Operating Temperature: -55 - 85°C; Series: SMD Comm X5R; Supplier 1: Mouser; Supplier Part Number 1: 80-C0603C104K9P; Type: Capacitor; Value: 100 nF; Live Cycle Status: 1; Stock number: not stored
C102 = CL10A105KB8NNNC: as C10 on sheet Power_Supply_LV; Supplier 1: LCSC; Supplier Part Number 1: C15849; Manufacturer Part Number: CL10A105KB8NNNC; Value: 1 µF; PartID: 5; Created On: 20.12.2020 13:54:13; ComponentLink1Description: Datasheet; ComponentLink1URL: https://datasheet.lcsc.com/lcsc/1810261812_Samsung-Electro-Mechanics-CL10A105KB8NNNC_C15849.pdf; Component Type: Capacitor 0603; Device Package: 0603; Last Updated: 28.11.2022 17:23:01; Mounting Type: SMD; Operating Temperature: -55 - 85°C; Series: M; Type: Capacitor; Tolerance: 10 %; Live Cycle Status: 1; LCSC Part Number: C15849; Stock number: Labor SMD Container
D1-D4 = 1SS356VMFHTE-17: Diode; Manufacturer_Name: ROHM Semiconductor; Datasheet Link: https://fscdn.rohm.com/en/products/databook/datasheet/discrete/diode/switching/1ss355vmfhte-17-e.pdf; Height: 0.9mm; Manufacturer_Part_Number: 1SS356VMFHTE-17; Mouser Part Number: 755-1SS356VMFHTE-17; Mouser Price/Stock: https://www.mouser.co.uk/ProductDetail/ROHM-Semiconductor/1SS356VMFHTE-17?qs=doiCPypUmgG12xHjyvfQdg%3D%3D; Supplier 1: Mouser; Supplier Part Number 1: 755-1SS356VMFHTE-17
IC1 = SI8920BC-IP: Integrated Circuit - Trennverstärker Isolated analog amplifier with 200 mV input; Manufacturer_Name: Skyworks Solutions Inc; Datasheet Link: https://www.skyworksinc.com/-/media/Skyworks/SL/documents/public/data-sheets/si8920-datasheet.pdf; Height: 4.19mm; Manufacturer_Part_Number: SI8920BC-IP; Mouser Part Number: 634-SI8920BC-IP; Mouser Price/Stock: 6,74 €; Supplier 1: Farnell; Supplier Part Number 1: 2930395
IC2 = ADA4940-1ARZ-R7: Differential ADC Driver; Manufacturer: Analog Devices; Class I: Analog; Class II: Fully Differential ADC Drivers (-40-125°C); Best.-Nr.: Farnell 209-6178; Channels: 1; Created from: MGremer; Datasheet: DSO11449, Ver. Aug 2000; Last edited: 04.01.2007 10:14; Package Reference: SOIC-N-8; Manufacturer Part Number: ADA4940-1ARZ-R7; PartID: 3; Created On: 15.01.2021 12:16:53; ComponentLink1Description: Datasheet; ComponentLink1URL: https://www.mouser.de/datasheet/2/609/ADA4940-1_4940-2-878284.pdf; Component Type: ADC; Device Package: SOIC-8; Last Updated: 22.11.2021 15:19:18; Mounting Type: SMD; Operating Temperature: -40 - 105 °C; Supplier 1: Mouser; Supplier Part Number 1: 584-ADA4940-1ARZ-R7; Type: ADC; Resolution: -; Value: differential ADC driver; Live Cycle Status: 1; Stock number: not stored
J8 = BNC5-J-P-GN-ST-TH2D_new: BNC Connector; Supplier 1: Mouser; Supplier Part Number 1: 200-BNC5JPGNSTTH2D
R85 R86 = RC0603FR-0749R9L: 100mW Thick Film Resistors ±100ppm/℃ ±1% 49.9Ω 0603 Chip Resistor - Surface Mount ROHS; Manufacturer: YAGEO; Created from: AGeiger; Value: 49R9; Manufacturer Part Number: RC0603FR-0749R9L; PartID: 277; Created On: 14.06.2023 17:42:26; ComponentLink1Description: Datasheet; ComponentLink1URL: https://datasheet.lcsc.com/lcsc/2304140030_YAGEO-RC0603FR-0749R9L_C114625.pdf; Component Type: SMD resistor; Device Package: 0603; Last Updated: 14.06.2023 17:42:26; Mounting Type: SMD; Type: Resistor; Tolerance: 1%; Live Cycle Status: 1; LCSC Part Number: C114625; Supplier 1: Mouser; Supplier Part Number 1: 603-RC0603FR-0749R9L
R87 R90 = ERA-8AEB302V: Resistor - SMD 1206 3.0Kohm 0.1% 25ppm; Manufacturer: Panasonic; Man. Part Number: ERA-8AEB302V; Value: 3k; Supplier 1: Mouser; Supplier Part Number 1: 667-ERA-8AEB302V
R88 R89 = ERA-8AEB102V: Resistor - SMD 1206 1.0Kohm 0.1% 25ppm; Manufacturer: Panasonic; Supplier 1: Mouser; Supplier Part Number 1: 667-ERA-8AEB102V; Man. Part Number: ERA-8AEB102V; Value: 1k

## Sheet Spannungsteiler_low.SchDoc
size A4; Author: T. Gaupp; CompanyName: Technische Hochschule Nürnberg Georg Simon Ohm; Address1: Fürther Straße 250; Address2: 90429 Nürnberg; Address3: GERMANY; SheetNumber: 5; SheetTotal: 6; CompanyName2: Institut ELSYS
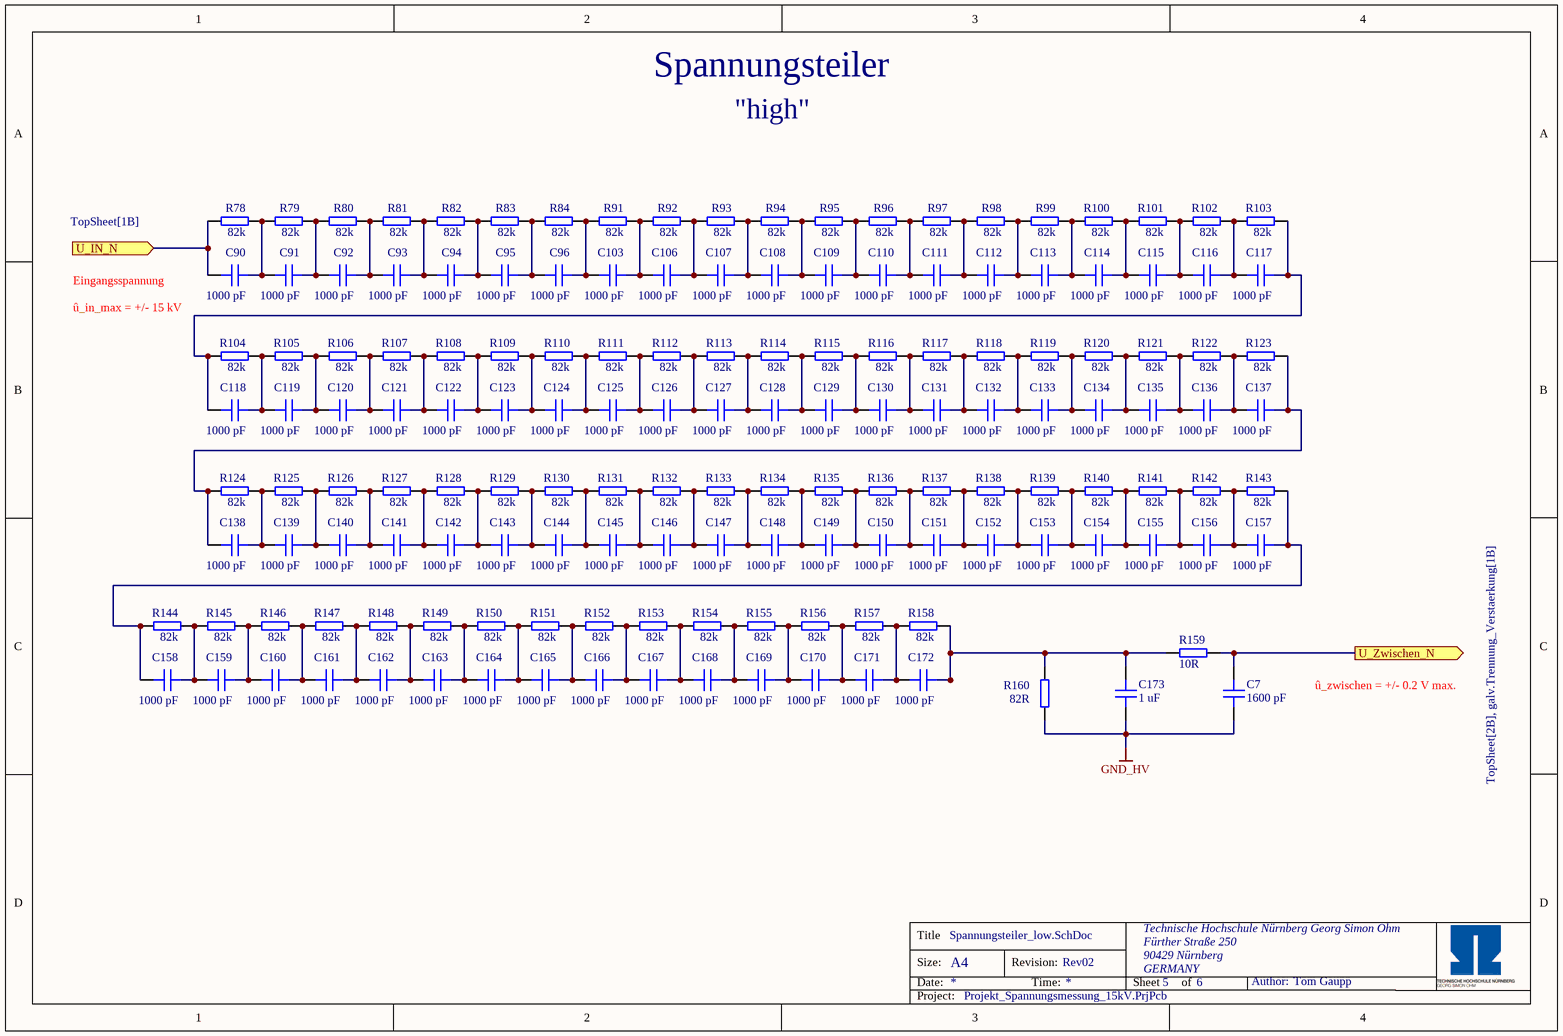
[diagram p5: Spannungsteiler_low.SchDoc]

### Parts
C7  1600 pF  [C_1206]
C90  1000 pF  [C_1206]
C91  1000 pF  [C_1206]
C92  1000 pF  [C_1206]
C93  1000 pF  [C_1206]
C94  1000 pF  [C_1206]
C95  1000 pF  [C_1206]
C96  1000 pF  [C_1206]
C103  1000 pF  [C_1206]
C106  1000 pF  [C_1206]
C107  1000 pF  [C_1206]
C108  1000 pF  [C_1206]
C109  1000 pF  [C_1206]
C110  1000 pF  [C_1206]
C111  1000 pF  [C_1206]
C112  1000 pF  [C_1206]
C113  1000 pF  [C_1206]
C114  1000 pF  [C_1206]
C115  1000 pF  [C_1206]
C116  1000 pF  [C_1206]
C117  1000 pF  [C_1206]
C118  1000 pF  [C_1206]
C119  1000 pF  [C_1206]
C120  1000 pF  [C_1206]
C121  1000 pF  [C_1206]
C122  1000 pF  [C_1206]
C123  1000 pF  [C_1206]
C124  1000 pF  [C_1206]
C125  1000 pF  [C_1206]
C126  1000 pF  [C_1206]
C127  1000 pF  [C_1206]
C128  1000 pF  [C_1206]
C129  1000 pF  [C_1206]
C130  1000 pF  [C_1206]
C131  1000 pF  [C_1206]
C132  1000 pF  [C_1206]
C133  1000 pF  [C_1206]
C134  1000 pF  [C_1206]
C135  1000 pF  [C_1206]
C136  1000 pF  [C_1206]
C137  1000 pF  [C_1206]
C138  1000 pF  [C_1206]
C139  1000 pF  [C_1206]
C140  1000 pF  [C_1206]
C141  1000 pF  [C_1206]
C142  1000 pF  [C_1206]
C143  1000 pF  [C_1206]
C144  1000 pF  [C_1206]
C145  1000 pF  [C_1206]
C146  1000 pF  [C_1206]
C147  1000 pF  [C_1206]
C148  1000 pF  [C_1206]
C149  1000 pF  [C_1206]
C150  1000 pF  [C_1206]
C151  1000 pF  [C_1206]
C152  1000 pF  [C_1206]
C153  1000 pF  [C_1206]
C154  1000 pF  [C_1206]
C155  1000 pF  [C_1206]
C156  1000 pF  [C_1206]
C157  1000 pF  [C_1206]
C158  1000 pF  [C_1206]
C159  1000 pF  [C_1206]
C160  1000 pF  [C_1206]
C161  1000 pF  [C_1206]
C162  1000 pF  [C_1206]
C163  1000 pF  [C_1206]
C164  1000 pF  [C_1206]
C165  1000 pF  [C_1206]
C166  1000 pF  [C_1206]
C167  1000 pF  [C_1206]
C168  1000 pF  [C_1206]
C169  1000 pF  [C_1206]
C170  1000 pF  [C_1206]
C171  1000 pF  [C_1206]
C172  1000 pF  [C_1206]
C173  1 uF  [C_1206]
R78  82k  [RES 1206_3216]
R79  82k  [RES 1206_3216]
R80  82k  [RES 1206_3216]
R81  82k  [RES 1206_3216]
R82  82k  [RES 1206_3216]
R83  82k  [RES 1206_3216]
R84  82k  [RES 1206_3216]
R91  82k  [RES 1206_3216]
R92  82k  [RES 1206_3216]
R93  82k  [RES 1206_3216]
R94  82k  [RES 1206_3216]
R95  82k  [RES 1206_3216]
R96  82k  [RES 1206_3216]
R97  82k  [RES 1206_3216]
R98  82k  [RES 1206_3216]
R99  82k  [RES 1206_3216]
R100  82k  [RES 1206_3216]
R101  82k  [RES 1206_3216]
R102  82k  [RES 1206_3216]
R103  82k  [RES 1206_3216]
R104  82k  [RES 1206_3216]
R105  82k  [RES 1206_3216]
R106  82k  [RES 1206_3216]
R107  82k  [RES 1206_3216]
R108  82k  [RES 1206_3216]
R109  82k  [RES 1206_3216]
R110  82k  [RES 1206_3216]
R111  82k  [RES 1206_3216]
R112  82k  [RES 1206_3216]
R113  82k  [RES 1206_3216]
R114  82k  [RES 1206_3216]
R115  82k  [RES 1206_3216]
R116  82k  [RES 1206_3216]
R117  82k  [RES 1206_3216]
R118  82k  [RES 1206_3216]
R119  82k  [RES 1206_3216]
R120  82k  [RES 1206_3216]
R121  82k  [RES 1206_3216]
R122  82k  [RES 1206_3216]
R123  82k  [RES 1206_3216]
R124  82k  [RES 1206_3216]
R125  82k  [RES 1206_3216]
R126  82k  [RES 1206_3216]
R127  82k  [RES 1206_3216]
R128  82k  [RES 1206_3216]
R129  82k  [RES 1206_3216]
R130  82k  [RES 1206_3216]
R131  82k  [RES 1206_3216]
R132  82k  [RES 1206_3216]
R133  82k  [RES 1206_3216]
R134  82k  [RES 1206_3216]
R135  82k  [RES 1206_3216]
R136  82k  [RES 1206_3216]
R137  82k  [RES 1206_3216]
R138  82k  [RES 1206_3216]
R139  82k  [RES 1206_3216]
R140  82k  [RES 1206_3216]
R141  82k  [RES 1206_3216]
R142  82k  [RES 1206_3216]
R143  82k  [RES 1206_3216]
R144  82k  [RES 1206_3216]
R145  82k  [RES 1206_3216]
R146  82k  [RES 1206_3216]
R147  82k  [RES 1206_3216]
R148  82k  [RES 1206_3216]
R149  82k  [RES 1206_3216]
R150  82k  [RES 1206_3216]
R151  82k  [RES 1206_3216]
R152  82k  [RES 1206_3216]
R153  82k  [RES 1206_3216]
R154  82k  [RES 1206_3216]
R155  82k  [RES 1206_3216]
R156  82k  [RES 1206_3216]
R157  82k  [RES 1206_3216]
R158  82k  [RES 1206_3216]
R159  10R  [RES 0603_1608]
R160  82R  [RES 1206_3216]

### Ports
U_IN_N (in, see TopSheet[1B]), U_Zwischen_N (out, see TopSheet[2B], galv.Trennung_Verstaerkung[1B])

### Nets
GND_HV: C7.1 C173.1 R160.1
U_Zwischen_N: C7.2 R159.2 ; port U_Zwischen_N
NetC90_1: C90.1 R78.1 ; port U_IN_N
NetC90_2: C90.2 C91.1 R78.2 R79.1
NetC91_2: C91.2 C92.1 R79.2 R80.1
NetC92_2: C92.2 C93.1 R80.2 R81.1
NetC93_2: C93.2 C94.1 R81.2 R82.1
NetC94_2: C94.2 C95.1 R82.2 R83.1
NetC95_2: C95.2 C96.1 R83.2 R84.1
NetC96_2: C96.2 C103.1 R84.2 R91.1
NetC103_2: C103.2 C106.1 R91.2 R92.1
NetC106_2: C106.2 C107.1 R92.2 R93.1
NetC107_2: C107.2 C108.1 R93.2 R94.1
NetC108_2: C108.2 C109.1 R94.2 R95.1
NetC109_2: C109.2 C110.1 R95.2 R96.1
NetC110_2: C110.2 C111.1 R96.2 R97.1
NetC111_2: C111.2 C112.1 R97.2 R98.1
NetC112_2: C112.2 C113.1 R98.2 R99.1
NetC113_2: C113.2 C114.1 R99.2 R100.1
NetC114_2: C114.2 C115.1 R100.2 R101.1
NetC115_2: C115.2 C116.1 R101.2 R102.1
NetC116_2: C116.2 C117.1 R102.2 R103.1
NetC117_2: C117.2 C118.1 R103.2 R104.1
NetC118_2: C118.2 C119.1 R104.2 R105.1
NetC119_2: C119.2 C120.1 R105.2 R106.1
NetC120_2: C120.2 C121.1 R106.2 R107.1
NetC121_2: C121.2 C122.1 R107.2 R108.1
NetC122_2: C122.2 C123.1 R108.2 R109.1
NetC123_2: C123.2 C124.1 R109.2 R110.1
NetC124_2: C124.2 C125.1 R110.2 R111.1
NetC125_2: C125.2 C126.1 R111.2 R112.1
NetC126_2: C126.2 C127.1 R112.2 R113.1
NetC127_2: C127.2 C128.1 R113.2 R114.1
NetC128_2: C128.2 C129.1 R114.2 R115.1
NetC129_2: C129.2 C130.1 R115.2 R116.1
NetC130_2: C130.2 C131.1 R116.2 R117.1
NetC131_2: C131.2 C132.1 R117.2 R118.1
NetC132_2: C132.2 C133.1 R118.2 R119.1
NetC133_2: C133.2 C134.1 R119.2 R120.1
NetC134_2: C134.2 C135.1 R120.2 R121.1
NetC135_2: C135.2 C136.1 R121.2 R122.1
NetC136_2: C136.2 C137.1 R122.2 R123.1
NetC137_2: C137.2 C138.1 R123.2 R124.1
NetC138_2: C138.2 C139.1 R124.2 R125.1
NetC139_2: C139.2 C140.1 R125.2 R126.1
NetC140_2: C140.2 C141.1 R126.2 R127.1
NetC141_2: C141.2 C142.1 R127.2 R128.1
NetC142_2: C142.2 C143.1 R128.2 R129.1
NetC143_2: C143.2 C144.1 R129.2 R130.1
NetC144_2: C144.2 C145.1 R130.2 R131.1
NetC145_2: C145.2 C146.1 R131.2 R132.1
NetC146_2: C146.2 C147.1 R132.2 R133.1
NetC147_2: C147.2 C148.1 R133.2 R134.1
NetC148_2: C148.2 C149.1 R134.2 R135.1
NetC149_2: C149.2 C150.1 R135.2 R136.1
NetC150_2: C150.2 C151.1 R136.2 R137.1
NetC151_2: C151.2 C152.1 R137.2 R138.1
NetC152_2: C152.2 C153.1 R138.2 R139.1
NetC153_2: C153.2 C154.1 R139.2 R140.1
NetC154_2: C154.2 C155.1 R140.2 R141.1
NetC155_2: C155.2 C156.1 R141.2 R142.1
NetC156_2: C156.2 C157.1 R142.2 R143.1
NetC157_2: C157.2 C158.1 R143.2 R144.1
NetC158_2: C158.2 C159.1 R144.2 R145.1
NetC159_2: C159.2 C160.1 R145.2 R146.1
NetC160_2: C160.2 C161.1 R146.2 R147.1
NetC161_2: C161.2 C162.1 R147.2 R148.1
NetC162_2: C162.2 C163.1 R148.2 R149.1
NetC163_2: C163.2 C164.1 R149.2 R150.1
NetC164_2: C164.2 C165.1 R150.2 R151.1
NetC165_2: C165.2 C166.1 R151.2 R152.1
NetC166_2: C166.2 C167.1 R152.2 R153.1
NetC167_2: C167.2 C168.1 R153.2 R154.1
NetC168_2: C168.2 C169.1 R154.2 R155.1
NetC169_2: C169.2 C170.1 R155.2 R156.1
NetC170_2: C170.2 C171.1 R156.2 R157.1
NetC171_2: C171.2 C172.1 R157.2 R158.1
NetC172_2: C172.2 C173.2 R158.2 R159.1 R160.2

### Notes on the sheet
- Spannungsteiler
- "high"
- Eingangsspannung
- û_in_max = +/- 15 kV
- û_zwischen = +/- 0.2 V max.
- Title
- Size:
- Date:
- A4
- Revision:
- Time:
- Sheet
- of
- Author:
- Project:

### Library data of the parts
C7 = C1206C162K3HACTU: as C54 on sheet Spannungsteiler_high; Manufacturer Part Number: C1206C162K3HACTU; PartID: 136; Created On: 08.08.2023 12:37:56; ComponentLink1Description: Datasheet; ComponentLink1URL: https://www.mouser.de/datasheet/2/212/KEM_C1007_X8R_ULTRA_150C_SMD-1102703.pdf; Component Type: Capacitor 1206; Device Package: 1206; Last Updated: 08.08.2023 12:37:56; Mounting Type: SMD; Operating Temperature: -55 - 125°C; Series: SMD Comm X8R HT150C; Supplier 1: Mouser; Supplier Part Number 1: 80-C1206C162K3HACTU; Type: Capacitor; Value: 1600 pF; Live Cycle Status: 1; Stock number: not stored
C90-C96 C103 C106-C172 = C1206C102J2GACTU: as C13 on sheet Spannungsteiler_high; Supplier 1: Mouser; Supplier Part Number 1: 80-C1206C102J2G; Value: 1000 pF; Manufacturer Part Number: C1206C102J2GACTU; PartID: 135; Created On: 08.08.2023 10:37:32; ComponentLink1Description: Datasheet; ComponentLink1URL: https://www.mouser.de/datasheet/2/212/KEM_C1003_C0G_SMD-1101588.pdf; Component Type: Capacitor 1206; Device Package: 1206; Last Updated: 08.08.2023 10:37:39; Mounting Type: SMD; Operating Temperature: -55 - 125°C; Series: SMD Comm C0G; Type: Capacitor; Tolerance: 5 %; Voltage Rating: 200 VDC; Live Cycle Status: 1; LCSC Part Number: C2167363; Stock number: not stored
C173 = C1206X105J5RACTU: as C53 on sheet Spannungsteiler_high; Manufacturer Part Number: C1206X105J5RACTU; PartID: 137; Created On: 28.08.2023 09:04:24; ComponentLink1Description: Datasheet; ComponentLink1URL: https://www.mouser.de/datasheet/2/212/1/KEM_C1013_X7R_FT_CAP_SMD-1103280.pdf; Component Type: Capacitor 1206; Device Package: 1206; Last Updated: 28.08.2023 09:04:24; Mounting Type: SMD; Operating Temperature: -55 - 125°C; Series: SMD Comm X7R Flex; Supplier 1: Mouser; Supplier Part Number 1: 80-C1206X105J5RACTU; Type: Capacitor; Tolerance: 5 %; Value: 1 uF; Live Cycle Status: 1; Stock number: not stored
R78-R84 R91-R158 = TNPW120682K0BEEA: as R1 on sheet Spannungsteiler_high; Supplier 1: Mouser; Supplier Part Number 1: 71-TNPW120682K0BEEA; Value: 82k; Manufacturer Part Number: TNPW120682K0BEEA; PartID: 290; Created On: 08.08.2023 09:29:01; ComponentLink1Description: Datasheet; ComponentLink1URL: https://www.vishay.com/docs/28758/tnpw_e3.pdf; Component Type: SMD resistor; Device Package: 1206; Last Updated: 08.08.2023 09:29:01; Mounting Type: SMD; Type: Resistor; Live Cycle Status: 1; Stock number: not stored; LCSC Part Number: C2089369
R159 = CRCW060310R0FKTA: as R41 on sheet Spannungsteiler_high; Manufacturer Part Number: CRCW060310R0FKTA; PartID: 296; Created On: 28.08.2023 12:16:52; ComponentLink1Description: Datasheet; ComponentLink1URL: https://www.vishay.com/docs/20008/dcrcw.pdf; Component Type: SMD resistor; Device Package: 0603; Last Updated: 28.08.2023 12:16:52; Mounting Type: SMD; Supplier 1: Mouser; Supplier Part Number 1: 71-CRCW0603-10; Type: Resistor; Tolerance: 1 %; Value: 10R; Live Cycle Status: 1; Stock number: not stored; LCSC Part Number: C2091419
R160 = RT1206BRD0782RL: as R42 on sheet Spannungsteiler_high; Supplier 1: Mouser; Supplier Part Number 1: 603-RT1206BRD0782RL; Value: 82R; Manufacturer Part Number: RT1206BRD0782RL; PartID: 291; Created On: 08.08.2023 10:07:21; ComponentLink1Description: Datasheet; ComponentLink1URL: https://www.mouser.de/datasheet/2/447/PYu_RT_1_to_0_01_RoHS_L_12-3003070.pdf; Component Type: SMD resistor; Device Package: 1206; Last Updated: 08.08.2023 10:07:21; Mounting Type: SMD; Type: Resistor; Live Cycle Status: 1; Stock number: not stored; LCSC Part Number: C870908

## Nets that join several sheets
24V_IN: Power_Supply_LV (PS2.2 PS2.3), Power_Supply_HV (6 pins)
+5V_HV: Power_Supply_HV (C1.1 C2.1 C3.1 PS1.6), galv.Trennung_Verstaerkung (C97.1 IC1.1)
+5V_LV: Power_Supply_LV (C10.2 C11.2 C12.2 PS2.6), galv.Trennung_Verstaerkung (7 pins)
-5V_LV: Power_Supply_LV (C99.2 C100.2 C101.2 PS2.8), galv.Trennung_Verstaerkung (C105.1 D2.2 D4.2 IC2.6)
GND_HV: Spannungsteiler_high (C53.1 C54.1 R42.1), Power_Supply_HV (5 pins), galv.Trennung_Verstaerkung (C97.2 IC1.4), Spannungsteiler_low (C7.1 C173.1 R160.1)
GND_IN: Power_Supply_LV (PS2.1), Power_Supply_HV (5 pins)
GND_LV: TopSheet (5 pins), Power_Supply_LV (7 pins), galv.Trennung_Verstaerkung (8 pins)
NetC13_1: TopSheet (25 pins), Spannungsteiler_high (C13.1 R1.1)
NetC90_1: TopSheet (25 pins), Spannungsteiler_low (C90.1 R78.1)
U_OUT_N: TopSheet (J3.1 J7.1), galv.Trennung_Verstaerkung (R85.2)
U_OUT_P: TopSheet (J3.2), galv.Trennung_Verstaerkung (R86.2)
U_Zwischen_N: galv.Trennung_Verstaerkung (IC1.3), Spannungsteiler_low (C7.2 R159.2)
U_Zwischen_P: Spannungsteiler_high (C54.2 R41.2), galv.Trennung_Verstaerkung (IC1.2)